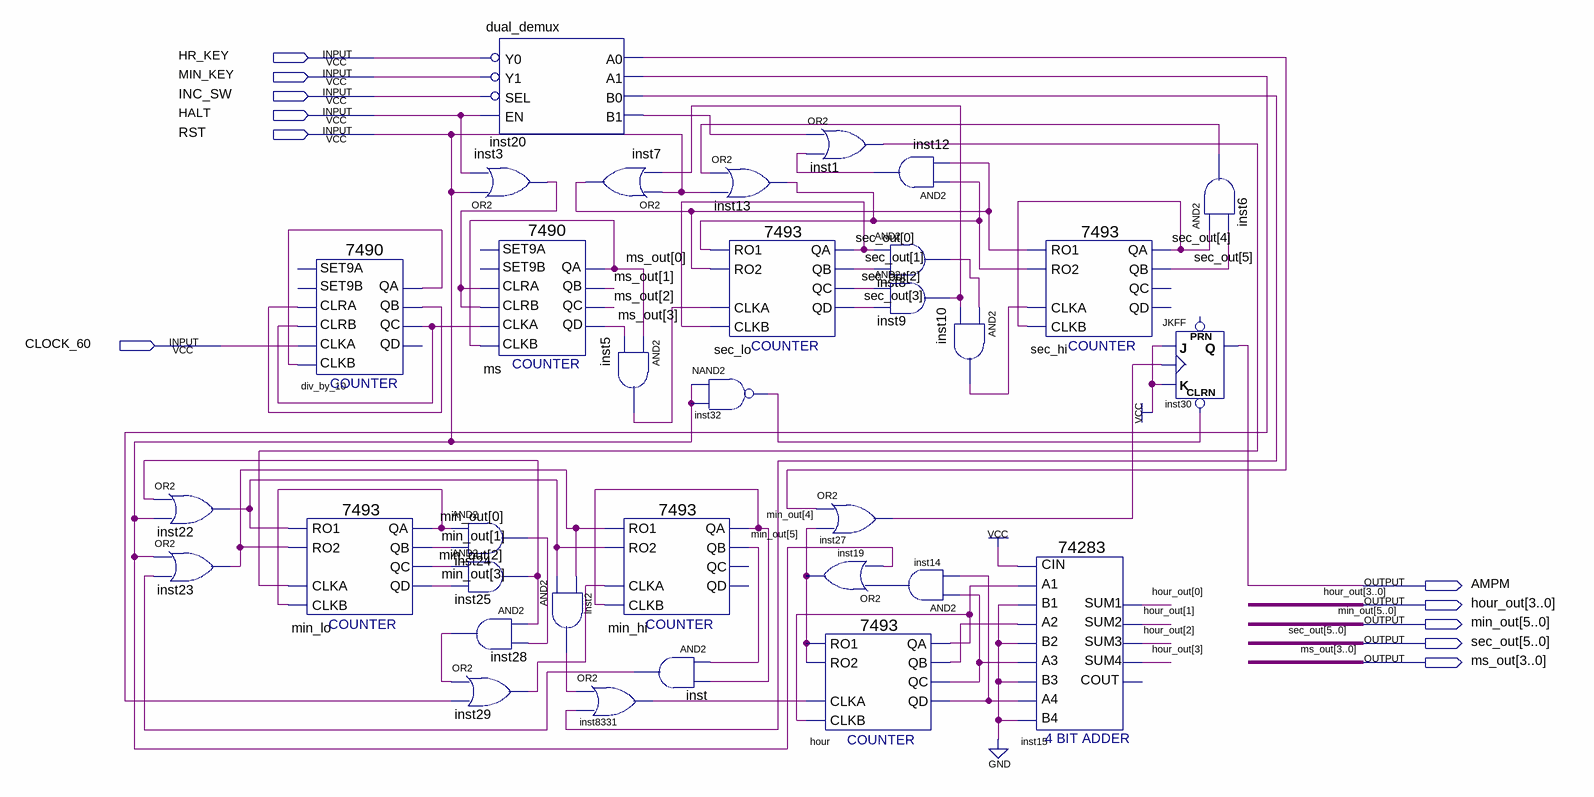
[diagram p0: schematic sheet]
// Quartus schematic binary_clock_datapath_rev2_1.bdf as structural Verilog: 33 symbols, 11 pins
module binary_clock_datapath_rev2_1 (
  input  HR_KEY,
  input  MIN_KEY,
  input  INC_SW,
  input  HALT,
  input  RST,
  input  CLOCK_60,
  output AMPM,
  output [3:0] hour_out,
  output [5:0] min_out,
  output [5:0] sec_out,
  output [3:0] ms_out
);

  wire div_by_10_qa, div_by_10_qb, div_by_10_qc, hour_qa, hour_qb, hour_qc, hour_qd, inst1_out, inst2_out,
       inst3_out, inst5_out, inst6_out, inst7_out, inst8_out, inst9_out, inst10_out, inst12_out, inst13_out,
       inst14_out, inst19_out, inst20_a0, inst20_a1, inst20_b0, inst20_b1, inst22_out, inst23_out,
       inst24_out, inst25_out, inst27_out, inst28_out, inst29_out, inst32_out, inst8331_out, inst_out;

  or inst22 (inst22_out, inst25_out, RST);
  or inst23 (inst23_out, RST, inst_out);
  \7490  div_by_10 (
    .CLRA(div_by_10_qb), .CLKB(div_by_10_qa), .CLKA(CLOCK_60), .CLRB(div_by_10_qc), .QA(div_by_10_qa),
    .QB(div_by_10_qb), .QC(div_by_10_qc));  // open: SET9A, SET9B, QD
  \7493  min_lo (
    .RO1(inst22_out), .RO2(inst23_out), .CLKA(inst1_out), .CLKB(min_out[0]), .QC(min_out[2]),
    .QB(min_out[1]), .QA(min_out[0]), .QD(min_out[3]));
  dual_demux inst20 (
    .EN(HALT), .SEL(~INC_SW), .Y0(~HR_KEY), .Y1(~MIN_KEY), .A0(inst20_a0), .A1(inst20_a1), .B0(inst20_b0),
    .B1(inst20_b1));
  or inst3 (inst3_out, RST, HALT);
  \7490  ms (
    .CLRA(inst3_out), .CLKB(ms_out[0]), .CLKA(div_by_10_qc), .CLRB(inst3_out), .QD(ms_out[3]),
    .QA(ms_out[0]), .QB(ms_out[1]), .QC(ms_out[2]));  // open: SET9A, SET9B
  and inst24 (inst24_out, min_out[0], min_out[1]);
  and inst25 (inst25_out, min_out[2], min_out[3]);
  and inst28 (inst28_out, inst25_out, inst24_out);
  or inst29 (inst29_out, inst28_out, inst20_a1);
  and inst2 (inst2_out, inst22_out, inst23_out);
  or inst8331 (inst8331_out, inst2_out, inst20_b0);
  or inst7 (inst7_out, RST, inst9_out);
  and inst5 (inst5_out, ms_out[0], ms_out[3]);
  \7493  min_hi (
    .RO1(inst23_out), .RO2(inst22_out), .CLKA(inst29_out), .CLKB(min_out[4]), .QB(min_out[5]), .QA(min_out[4]));  // open: QC, QD
  and inst (inst_out, min_out[5], min_out[4]);
  or inst13 (inst13_out, inst6_out, RST);
  \7493  sec_lo (
    .RO1(inst13_out), .RO2(inst7_out), .CLKA(inst5_out), .CLKB(sec_out[0]), .QC(sec_out[2]), .QB(sec_out[1]),
    .QA(sec_out[0]), .QD(sec_out[3]));
  nand inst32 (inst32_out, RST, RST);
  or inst1 (inst1_out, inst20_b1, inst12_out);
  or inst19 (inst19_out, inst14_out, RST);
  \7493  hour (
    .RO1(inst19_out), .RO2(inst19_out), .CLKA(inst8331_out), .CLKB(hour_qa), .QC(hour_qc), .QB(hour_qb),
    .QA(hour_qa), .QD(hour_qd));
  and inst12 (inst12_out, inst13_out, inst7_out);
  and inst8 (inst8_out, sec_out[0], sec_out[1]);
  and inst9 (inst9_out, sec_out[2], sec_out[3]);
  or inst27 (inst27_out, inst20_a0, inst19_out);
  and inst14 (inst14_out, hour_qc, hour_qd);
  and inst10 (inst10_out, inst8_out, inst9_out);
  \7493  sec_hi (
    .RO1(inst7_out), .RO2(inst13_out), .CLKA(inst10_out), .CLKB(sec_out[4]), .QB(sec_out[5]), .QA(sec_out[4]));  // open: QC, QD
  \74283  inst15 (
    .CIN(1'b1), .A1(hour_qa), .A2(hour_qb), .B2(1'b0), .A3(hour_qc), .A4(hour_qd), .B4(1'b0), .B1(1'b0),
    .B3(1'b0), .SUM4(hour_out[3]), .SUM1(hour_out[0]), .SUM2(hour_out[1]), .SUM3(hour_out[2]));  // open: COUT
  and inst6 (inst6_out, sec_out[4], sec_out[5]);
  JKFF inst30 (.CLRN(inst32_out), .K(1'b1), .J(1'b1), .CLK(inst27_out), .Q(AMPM));  // open: PRN
endmodule
